# EAGLE schematic USB (EAGLE 9.2.0)
COMPANY: ADAFRUIT INDUSTRIES; DRAWN: KTOWN; REV: B
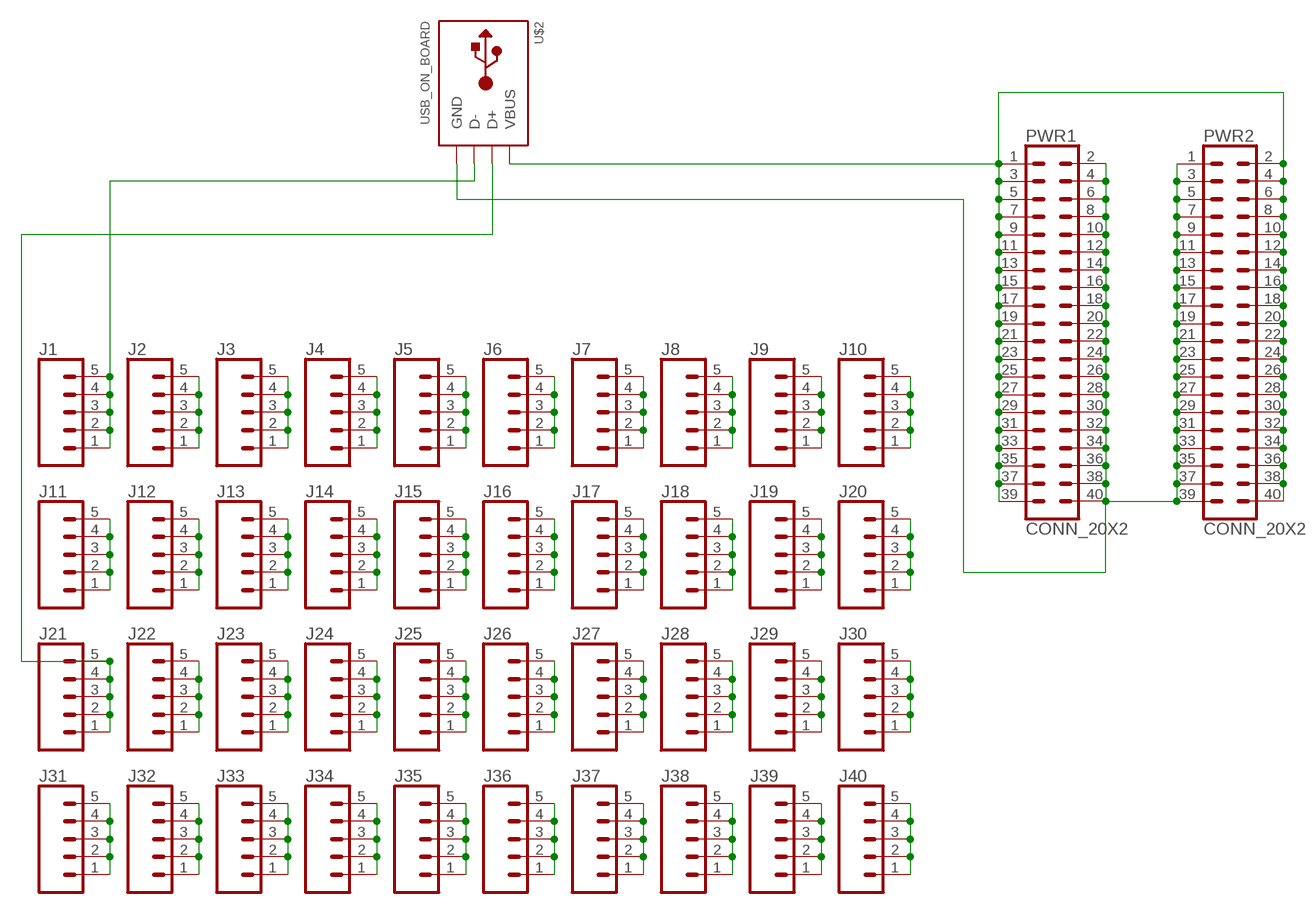
[diagram p0: schematic, sheet 1]

## Parts
J1  CONN_05  [1X05]
J2  CONN_05  [1X05]
J3  CONN_05  [1X05]
J4  CONN_05  [1X05]
J5  CONN_05  [1X05]
J6  CONN_05  [1X05]
J7  CONN_05  [1X05]
J8  CONN_05  [1X05]
J9  CONN_05  [1X05]
J10  CONN_05  [1X05]
J11  CONN_05  [1X05]
J12  CONN_05  [1X05]
J13  CONN_05  [1X05]
J14  CONN_05  [1X05]
J15  CONN_05  [1X05]
J16  CONN_05  [1X05]
J17  CONN_05  [1X05]
J18  CONN_05  [1X05]
J19  CONN_05  [1X05]
J20  CONN_05  [1X05]
J21  CONN_05  [1X05]
J22  CONN_05  [1X05]
J23  CONN_05  [1X05]
J24  CONN_05  [1X05]
J25  CONN_05  [1X05]
J26  CONN_05  [1X05]
J27  CONN_05  [1X05]
J28  CONN_05  [1X05]
J29  CONN_05  [1X05]
J30  CONN_05  [1X05]
J31  CONN_05  [1X05]
J32  CONN_05  [1X05]
J33  CONN_05  [1X05]
J34  CONN_05  [1X05]
J35  CONN_05  [1X05]
J36  CONN_05  [1X05]
J37  CONN_05  [1X05]
J38  CONN_05  [1X05]
J39  CONN_05  [1X05]
J40  CONN_05  [1X05]
PWR1  CONN_20X2  [2X20]
PWR2  CONN_20X2  [2X20]
U$2  USB_ON_BOARD  [USB_ON_BOARD]

## Nets
N$1: J1.1 J1.2 J1.3 J1.4 J1.5 U$2.D-
N$2: J2.1 J2.2 J2.3 J2.4 J2.5
N$3: J3.1 J3.2 J3.3 J3.4 J3.5
N$4: J4.1 J4.2 J4.3 J4.4 J4.5
N$5: J5.1 J5.2 J5.3 J5.4 J5.5
N$6: J6.1 J6.2 J6.3 J6.4 J6.5
N$7: J7.1 J7.2 J7.3 J7.4 J7.5
N$8: J8.1 J8.2 J8.3 J8.4 J8.5
N$9: J9.1 J9.2 J9.3 J9.4 J9.5
N$10: J10.1 J10.2 J10.3 J10.4 J10.5
N$11: J11.1 J11.2 J11.3 J11.4 J11.5
N$12: J12.1 J12.2 J12.3 J12.4 J12.5
N$13: J13.1 J13.2 J13.3 J13.4 J13.5
N$14: J14.1 J14.2 J14.3 J14.4 J14.5
N$15: J15.1 J15.2 J15.3 J15.4 J15.5
N$16: J16.1 J16.2 J16.3 J16.4 J16.5
N$17: J17.1 J17.2 J17.3 J17.4 J17.5
N$18: J18.1 J18.2 J18.3 J18.4 J18.5
N$19: J19.1 J19.2 J19.3 J19.4 J19.5
N$20: J20.1 J20.2 J20.3 J20.4 J20.5
N$21: J21.1 J21.2 J21.3 J21.4 J21.5 U$2.D+
N$22: J22.1 J22.2 J22.3 J22.4 J22.5
N$23: J23.1 J23.2 J23.3 J23.4 J23.5
N$24: J24.1 J24.2 J24.3 J24.4 J24.5
N$25: J25.1 J25.2 J25.3 J25.4 J25.5
N$26: J26.1 J26.2 J26.3 J26.4 J26.5
N$27: J27.1 J27.2 J27.3 J27.4 J27.5
N$28: J28.1 J28.2 J28.3 J28.4 J28.5
N$29: J29.1 J29.2 J29.3 J29.4 J29.5
N$30: J30.1 J30.2 J30.3 J30.4 J30.5
N$31: J31.1 J31.2 J31.3 J31.4 J31.5
N$32: J32.1 J32.2 J32.3 J32.4 J32.5
N$33: J33.1 J33.2 J33.3 J33.4 J33.5
N$34: J34.1 J34.2 J34.3 J34.4 J34.5
N$35: J35.1 J35.2 J35.3 J35.4 J35.5
N$36: J36.1 J36.2 J36.3 J36.4 J36.5
N$37: J37.1 J37.2 J37.3 J37.4 J37.5
N$38: J38.1 J38.2 J38.3 J38.4 J38.5
N$39: J39.1 J39.2 J39.3 J39.4 J39.5
N$40: J40.1 J40.2 J40.3 J40.4 J40.5
N$41: PWR1.1 PWR1.3 PWR1.5 PWR1.7 PWR1.9 PWR1.11 PWR1.13 PWR1.15 PWR1.17 PWR1.19 PWR1.21 PWR1.23 PWR1.25 PWR1.27 PWR1.29 PWR1.31 PWR1.33 PWR1.35 PWR1.37 PWR1.39 PWR2.2 PWR2.4 PWR2.6 PWR2.8 PWR2.10 PWR2.12 PWR2.14 PWR2.16 PWR2.18 PWR2.20 PWR2.22 PWR2.24 PWR2.26 PWR2.28 PWR2.30 PWR2.32 PWR2.34 PWR2.36 PWR2.38 PWR2.40 U$2.VCC(VBUS)
N$42: PWR1.2 PWR1.4 PWR1.6 PWR1.8 PWR1.10 PWR1.12 PWR1.14 PWR1.16 PWR1.18 PWR1.20 PWR1.22 PWR1.24 PWR1.26 PWR1.28 PWR1.30 PWR1.32 PWR1.34 PWR1.36 PWR1.38 PWR1.40 PWR2.1 PWR2.3 PWR2.5 PWR2.7 PWR2.9 PWR2.11 PWR2.13 PWR2.15 PWR2.17 PWR2.19 PWR2.21 PWR2.23 PWR2.25 PWR2.27 PWR2.29 PWR2.31 PWR2.33 PWR2.35 PWR2.37 PWR2.39 U$2.GND

## Library data of the parts
J1-J40 = SparkFun-Connectors:CONN_05: Multi connection point. Often used as Generic Header-pin footprint for 0.1 inch spaced/style header connections On any of the 0.1 inch spaced packages, you can populate with these: Break Away Headers - Straight <https://www.sparkfun.com/products/116> (PRT-00116) Break Away Male Headers - Right Angle <https://www.sparkfun.com/products/553> (PRT-00553) Female Headers <https://www.sparkfun.com/products/115> (PRT-00115) Break Away Headers - Machine Pin <https://www.sparkfun.com/products/117> (PRT-00117) Break Away Female Headers - Swiss Machine Pin <https://www.sparkfun.com/products/743> (PRT-00743) For SCREWTERMINALS and SPRING TERMINALS visit here: Screw Terimnals on SparkFun.com <https://www.sparkfun.com/search/results?term=Screw+Terminals> (5mm/3.5mm/2.54mm spacing) This device is also useful as a general connection point to wire up your design to another part of your project. Our various solder wires solder well into these plated through hole pads. Hook-Up Wire - Assortment (Stranded, 22 AWG) <https://www.sparkfun.com/products/11375> (PRT-11375) Hook-Up Wire - Assortment (Solid Core, 22 AWG) <https://www.sparkfun.com/products/11367> (PRT-11367) View the entire wire category on our website here <https://www.sparkfun.com/categories/141> Special notes: Molex polarized connector foot print use with SKU : PRT-08231 with associated crimp pins and housings. 1MM SMD Version SKU: PRT-10208
PWR1 PWR2 = SparkFun-Connectors:CONN_20X2: Multi connection point. Often used as Generic Header-pin footprint for 0.1 inch spaced/style header connections On any of the 0.1 inch spaced packages, you can populate with these: Break Away Headers - Straight <https://www.sparkfun.com/products/116> (PRT-00116) Break Away Male Headers - Right Angle <https://www.sparkfun.com/products/553> (PRT-00553) Female Headers <https://www.sparkfun.com/products/115> (PRT-00115) Break Away Headers - Machine Pin <https://www.sparkfun.com/products/117> (PRT-00117) Break Away Female Headers - Swiss Machine Pin <https://www.sparkfun.com/products/743> (PRT-00743)
U$2 = Scott-Connectors:USB_ON_BOARD

## Net classes
1 power: width 0.178 mm